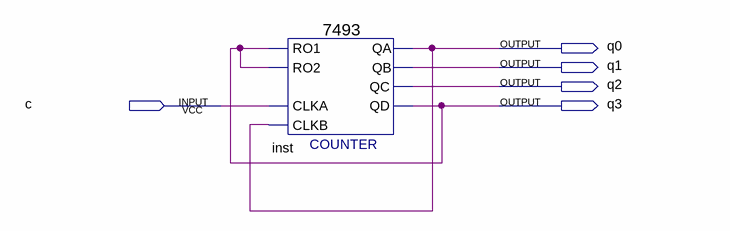
[diagram p0: schematic sheet]
// Quartus schematic p5_7493.bdf as structural Verilog: 1 symbols, 5 pins
module p5_7493 (
  input  c,
  output q0,
  output q1,
  output q2,
  output q3
);

  \7493  inst (.RO1(q3), .RO2(q3), .CLKA(c), .CLKB(q0), .QC(q2), .QB(q1), .QA(q0), .QD(q3));
endmodule
